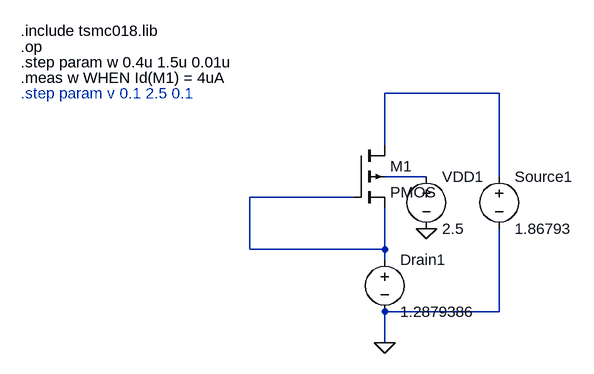
[diagram p0: schematic biasingPmos.asc]
biasingPmos.asc, the LTspice schematic file:
Version 4
SHEET 1 880 680
WIRE 416 -32 240 -32
WIRE 240 48 240 -32
WIRE 304 96 240 96
WIRE 416 96 416 -32
WIRE 192 128 32 128
WIRE 32 208 32 128
WIRE 240 208 240 144
WIRE 240 208 32 208
WIRE 240 224 240 208
WIRE 416 304 416 176
WIRE 416 304 240 304
WIRE 240 352 240 304
FLAG 240 352 0
FLAG 304 176 0
SYMBOL cmosp 192 48 R0
SYMATTR InstName M1
SYMATTR Value2 l=0.35u w={w}
SYMATTR Value PMOS
SYMBOL voltage 416 80 R0
WINDOW 123 0 0 Left 0
WINDOW 39 0 0 Left 0
SYMATTR InstName Source1
SYMATTR Value 1.86793
SYMBOL voltage 240 208 R0
WINDOW 123 0 0 Left 0
WINDOW 39 0 0 Left 0
SYMATTR InstName Drain1
SYMATTR Value 1.2879386
SYMBOL voltage 304 80 R0
WINDOW 123 0 0 Left 0
WINDOW 39 0 0 Left 0
SYMATTR InstName VDD1
SYMATTR Value 2.5
TEXT -320 -128 Left 2 !.include tsmc018.lib
TEXT -320 -104 Left 2 !.op
TEXT -320 -80 Left 2 !.step param w 0.4u 1.5u 0.01u
TEXT -320 -56 Left 2 !.meas w WHEN Id(M1) = 4uA
TEXT -320 -32 Left 2 ;.step param v 0.1 2.5 0.1

The netlist it stands for:
* biasingPmos.asc
M1 N001 N003 N003 N002 PMOS l=0.35u w={w}
V§Source1 N001 0 1.86793
V§Drain1 N003 0 1.2879386
VDD1 N002 0 2.5
.model NMOS NMOS
.model PMOS PMOS
.lib standard.mos
.include tsmc018.lib
.op
.step param w 0.4u 1.5u 0.01u
.meas w WHEN Id(M1) = 4uA
* .step param v 0.1 2.5 0.1
.backanno
.end